# Altium schematic sheet ICSL_PS_Combined_Shared.SchDoc: SEUS POWER + BREAKOUT
size A; DrawnBy: Stephen Xia; DocumentNumber: 3; Revision: 0.1; SheetNumber: 3; SheetTotal: 3
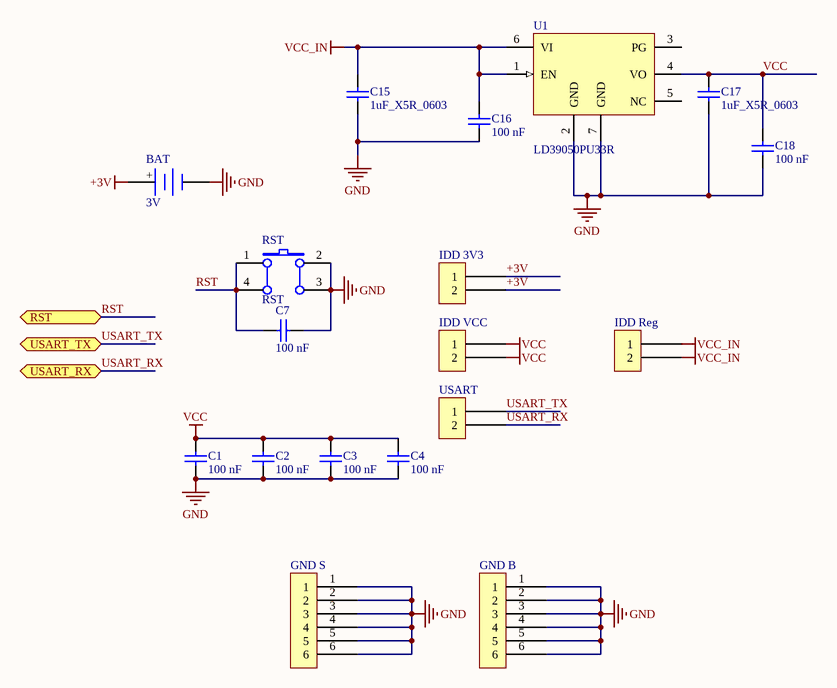
[diagram p0: ICSL_PS_Combined_Shared.SchDoc]

## Parts
BAT  3V  [PCB-ltikzgtn8bqt3ncdf2ka-1]
C1  100 nF  [CAPC1608X87X35LL15T15]
C2  100 nF  [CAPC1608X87X35LL15T15]
C3  100 nF  [CAPC1608X87X35LL15T15]
C4  100 nF  [CAPC1608X87X35LL15T15]
C7  100 nF  [CAPC1608X87X35LL15T15]
C15  1uF_X5R_0603  [CAPC1608X87X35LL15T15]
C16  100 nF  [CAPC1608X87X35LL15T15]
C17  1uF_X5R_0603  [CAPC1608X87X35LL15T15]
C18  100 nF  [CAPC1608X87X35LL15T15]
GND_B  TE Connectivity / AMP 5-146281-6  [PCB-ceua2d6kgzjhmbkiz2sm-1]  (value not drawn)
GND_S  TE Connectivity / AMP 5-146281-6  [PCB-ceua2d6kgzjhmbkiz2sm-1]  (value not drawn)
IDD_3V3  TE Connectivity / AMP 3-644695-2  [PCB-i8m17woc8q0u0fbeoczf-1]  (value not drawn)
IDD_Reg  TE Connectivity / AMP 3-644695-2  [PCB-i8m17woc8q0u0fbeoczf-1]  (value not drawn)
IDD_VCC  TE Connectivity / AMP 3-644695-2  [PCB-i8m17woc8q0u0fbeoczf-1]  (value not drawn)
RST  RST  [BP1CMS]
U1  LD39050PU33R  [DFN6(3X3)_A]
USART  TE Connectivity / AMP 3-644695-2  [PCB-i8m17woc8q0u0fbeoczf-1]  (value not drawn)

## Ports
RST (bidir), USART_RX (bidir), USART_TX (bidir)

## Nets
+3V: BAT.1(+) IDD_3V3.1 IDD_3V3.2
GND: BAT.2(-) C1.1 C2.1 C3.1 C4.1 C7.2 C15.1 C16.1 C17.1 C18.1 GND_B.1 GND_B.2 GND_B.3 GND_B.4 GND_B.5 GND_B.6 GND_S.1 GND_S.2 GND_S.3 GND_S.4 GND_S.5 GND_S.6 RST.2(B0) RST.3(B1) U1.2(GND) U1.7(GND)
VCC: C1.2 C2.2 C3.2 C4.2 C17.2 C18.2 IDD_VCC.1 IDD_VCC.2 U1.4(VO)
VCC_IN: C15.2 C16.2 IDD_Reg.1 IDD_Reg.2 U1.1(EN) U1.6(VI)
RST: C7.1 RST.1(A0) RST.4(A1) ; port RST
USART_RX: USART.2 ; port USART_RX
USART_TX: USART.1 ; port USART_TX

Not connected (* = marked no-connect by the designer): U1 3(PG) 5(NC)

## Library data of the parts
BAT = 1026: HOLDER BATTERY DUAL CELL 20MM; Manufacturer: Keystone Electronics; Manufacturer Part Number: 1026; Lead-Free Status: Lead Free; Wire Gauge: 1.0 AWG; REACH SVHC Compliance: No SVHC; Material: Thermoplastic; OctopartID: 41a888a28f699e6f; Octopart Url: https://octopart.com/1026-keystone-60327; Size-Diameter: 0.02 m; RoHS: Compliant; Contact Plating: Nickel
C1-C4 C7 C15-C18 = C0603C823K5RACTU: Multilayer Ceramic Capacitors MLCC - SMD/SMT 50volts 82000pF X7R 10%; Capacitance: 8.2e-08 F; Lead-Free Status: R; Voltage Rating (DC): 50.0 V; Capacitance Tolerance: ±10%; Case/Package: 0603; Dielectric Characteristic: X7R; Dielectric Material: Ceramic; Mounting Style: Surface Mount; Number of Pins: 2; Octopart Url: https://octopart.com/c0603c823k5ractu-kemet-9138604; OctopartID: 386ff1ee6ca5e7a8; Packaging: Cut Tape (CT); REACH SVHC Compliance: No SVHC; RoHS: Compliant
GND_B GND_S = 5-146281-2: Header; Breakaway; 0.100 in.; PC Board; Single; 6; 0.025 in.; 0.12 in.; 3 A; Gender: Male; Number of Contacts: 6; Lead-Free Status: Lead Free; ELV Compliant: Compliant; Lifecycle Status: Active; OctopartID: 4f28847cfb2a90ef; Manufacturer Part Number: 5-146281-2; Housing Color: Black; Flammability Rating: UL 94 V-0; Orientation: Vertical; Octopart URL: https://octopart.com/5-146281-6-te+connectivity+%2F+amp-40753677; Contact Plating: Tin, Tin over Nickel, Gold; Contact Material: Copper Alloy; RoHS: Compliant; Mounting Style: PCB
IDD_3V3 IDD_Reg IDD_VCC USART = 3-644695-2: Connector Unshrouded Header 2 Position 2.54mm Solder Straight Thru-Hole; Voltage Rating (AC): 250 V; Number of Positions: 2; Mounting Angle: 180 °; Lead-Free Status: Lead Free; Shrouded: No; ELV Compliant: Compliant; Gender: Male; Flammability Rating: UL 94 V-0; Number of Rows: 1; Housing Color: Natural; Size-Width: 2.34 mm; Mounting Style: Through Hole; Orientation: Vertical; Lifecycle Status: Active; Manufacturer Part Number: 3-644695-2; OctopartID: 2792ecc2f21af855; RoHS: Compliant; Pin Pitch: 2.54 mm; Contact Plating: Tin; Housing Material: Polyester; Size-Length: 4.80 mm; Contact Material: Copper Alloy; Size-Height: 2.54 mm; Number of Contacts: 2; Packaging: Box, Bag; Octopart URL: http://octopart.com/3-644695-2-te+connectivity+%2F+amp-39514350
RST = CMP-bffc74333cf8603b-2: Switch Tactile OFF (ON) SPST Round Button Gull Wing 0.05A 24VDC 1.57N SMD T/R; Manufacturer Part Number: 4-1437565-2; Lead-Free Status: Lead Free; ELV Compliant: Compliant; Contact Current Rating: 50.0 mA; REACH SVHC Compliance: No SVHC; Contact Plating: Silver; RoHS: Compliant; Contacts Type: SPST; OctopartID: bffc74333cf8603b; Packaging: Tape & Reel (TR); Lifecycle Status: Active; Seller Landing  Url: https://octopart-clicks.com/click/track?country=US&ak=8157f166&sig=0fb764e&sid=1106&ppid=46507618&vpid=195113533&ct=offers; Contact Material: Copper Alloy; Octopart Url: http://octopart.com/4-1437565-2-te+connectivity-46507618; Mounting Style: Surface Mount
U1 = LD39050PU33R: LD39050 Series 500 mA 3.3 V Fixed Low Noise LDO Voltage Regulator - DFN-6; Lead-Free Status: Lead Free; Lifecycle Status: Active; Octopart Url: http://octopart.com/ld39050pu33r-stmicroelectronics-42628004; RoHS: Compliant; OctopartID: 9cb95739ca7b437e; Manufacturer Part Number: LD39050PU33R; Seller Landing  Url: https://octopart-clicks.com/click/track?country=US&ak=8157f166&sig=03e676f&sid=1106&ppid=42628004&vpid=119747644&ct=offers